# Altium schematic sheet AFE.SchDoc
size A3; SheetNumber: 7; SheetTotal: 10
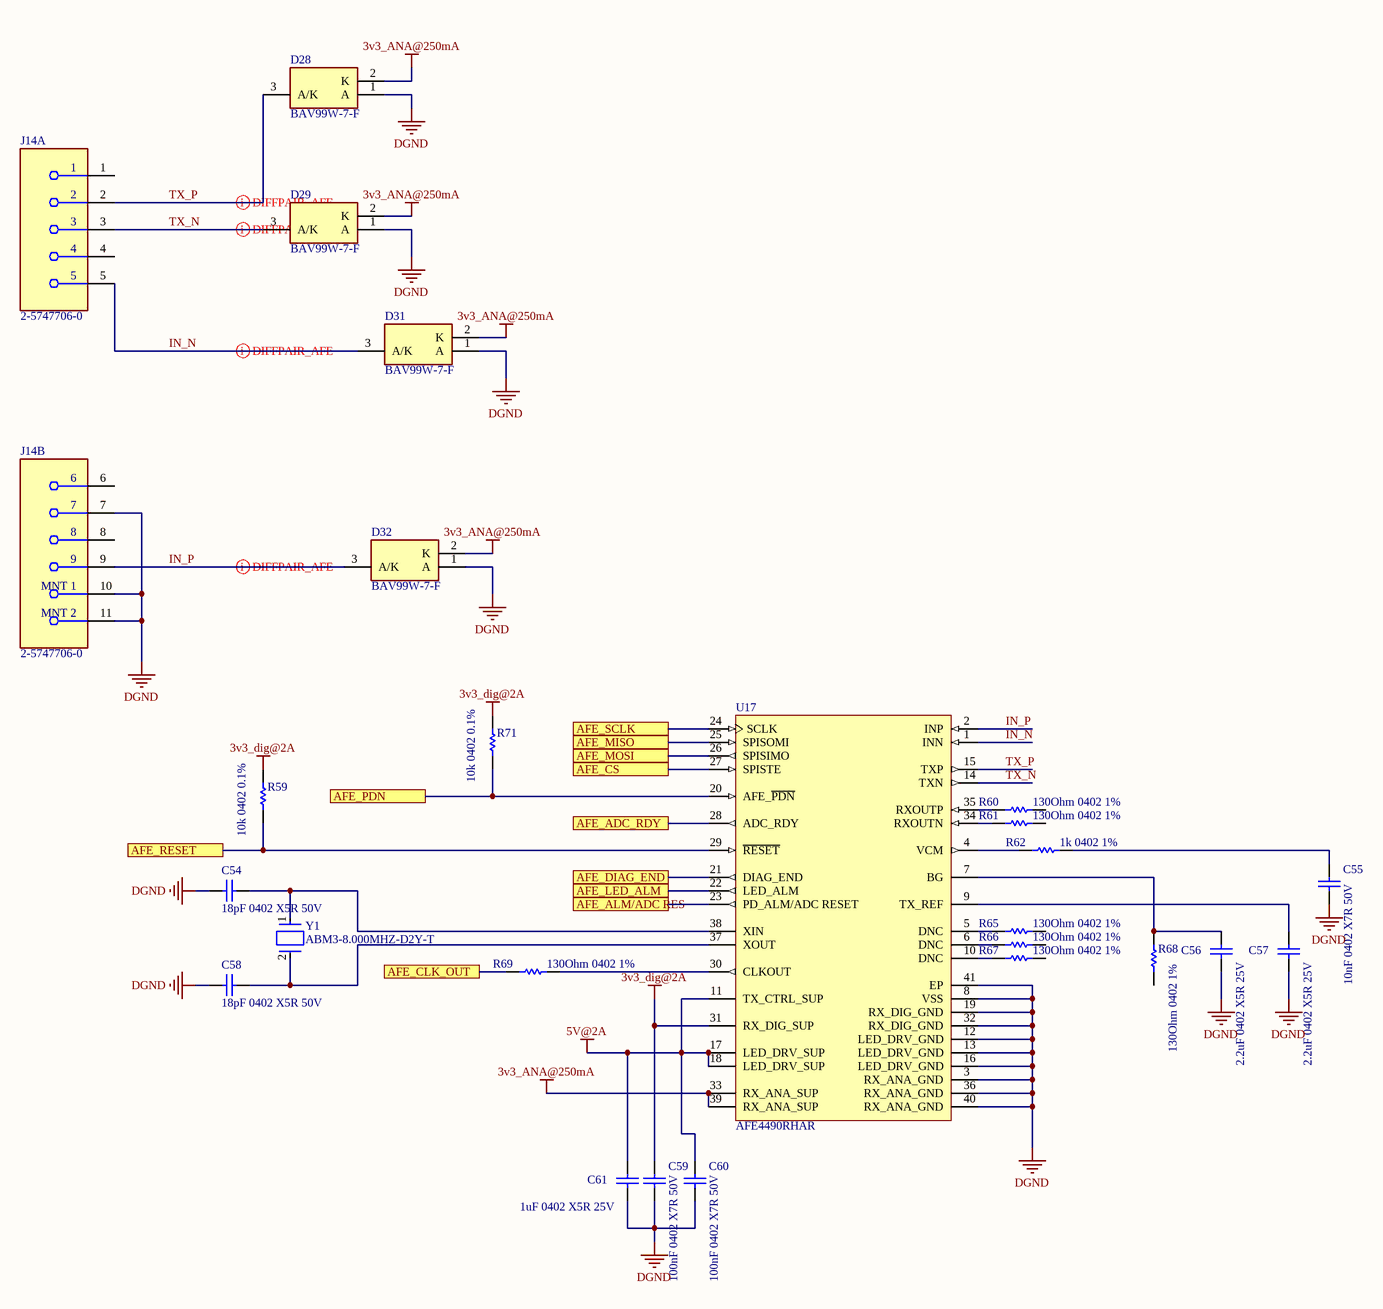
[diagram p0: AFE.SchDoc]

## Parts
C54  18pF 0402 X5R 50V  [CAPC1005X55X25NL5T10]
C55  10nF 0402 X7R 50V  [CAPC1005X55X25NL5T10]
C56  2.2uF 0402 X5R 25V  [CAPC1005X55X25NL5T10]
C57  2.2uF 0402 X5R 25V  [CAPC1005X55X25NL5T10]
C58  18pF 0402 X5R 50V  [CAPC1005X55X25NL5T10]
C59  100nF 0402 X7R 50V  [CAPC1005X55X25NL5T10]
C60  100nF 0402 X7R 50V  [CAPC1005X55X25NL5T10]
C61  1uF 0402 X5R 25V  [CAPC1005X55X25NL5T10]
D28  BAV99W-7-F  [SOT65P210X110-3N]
D29  BAV99W-7-F  [SOT65P210X110-3N]
D31  BAV99W-7-F  [SOT65P210X110-3N]
D32  BAV99W-7-F  [SOT65P210X110-3N]
J14  2-5747706-0  [FP-2-5747706-0-MFG]  (parts A,B of 2)
R59  10k 0402 0.1%  [RESC1005X40X25ML05T10]
R60  130Ohm 0402 1%  [RESC1005X40X25ML05T10]
R61  130Ohm 0402 1%  [RESC1005X40X25ML05T10]
R62  1k 0402 1%  [RESC1005X40X25ML05T10]
R65  130Ohm 0402 1%  [RESC1005X40X25ML05T10]
R66  130Ohm 0402 1%  [RESC1005X40X25ML05T10]
R67  130Ohm 0402 1%  [RESC1005X40X25ML05T10]
R68  130Ohm 0402 1%  [RESC1005X40X25ML05T10]
R69  130Ohm 0402 1%  [RESC1005X40X25ML05T10]
R71  10k 0402 0.1%  [RESC1005X40X25ML05T10]
U17  AFE4490RHAR  [RHA0040B_V]
Y1  ABM3-8.000MHZ-D2Y-T  [FP-ABM3-MFG]

## Ports
AFE_ADC_RDY, AFE_ALM/ADC RES, AFE_CLK_OUT, AFE_CS, AFE_DIAG_END, AFE_LED_ALM, AFE_MISO, AFE_MOSI, AFE_PDN, AFE_RESET, AFE_SCLK

## Nets
3v3_ANA@250mA: D28.2(K) D29.2(K) D31.2(K) D32.2(K) U17.33(RX_ANA_SUP) U17.39(RX_ANA_SUP)
3v3_dig@2A: C59.2 R59.2 R71.2 U17.31(RX_DIG_SUP)
5V@2A: C60.2 C61.2 U17.11(TX_CTRL_SUP) U17.17(LED_DRV_SUP) U17.18(LED_DRV_SUP)
DGND: C54.1 C55.1 C56.1 C57.1 C58.1 C59.1 C60.1 C61.1 D28.1(A) D29.1(A) D31.1(A) D32.1(A) J14.7 J14.10(MNT_1) J14.11(MNT_2) U17.3(RX_ANA_GND) U17.8(VSS) U17.12(LED_DRV_GND) U17.13(LED_DRV_GND) U17.16(LED_DRV_GND) U17.19(RX_DIG_GND) U17.32(RX_DIG_GND) U17.36(RX_ANA_GND) U17.40(RX_ANA_GND) U17.41(EP)
AFE_ADC_RDY: U17.28(ADC_RDY) ; port AFE_ADC_RDY
AFE_ALM/ADC RES: U17.23(PD_ALM/ADC_RESET) ; port AFE_ALM/ADC RES
AFE_CLK_OUT: R69.2 ; port AFE_CLK_OUT
AFE_CS: U17.27(SPISTE) ; port AFE_CS
AFE_DIAG_END: U17.21(DIAG_END) ; port AFE_DIAG_END
AFE_LED_ALM: U17.22(LED_ALM) ; port AFE_LED_ALM
AFE_MISO: U17.25(SPISOMI) ; port AFE_MISO
AFE_MOSI: U17.26(SPISIMO) ; port AFE_MOSI
AFE_PDN: R71.1 U17.20(AFE_~{PDN}) ; port AFE_PDN
AFE_RESET: R59.1 U17.29(~{RESET}) ; port AFE_RESET
AFE_SCLK: U17.24(SCLK) ; port AFE_SCLK
IN_N: D31.3(A/K) J14.5 U17.1(INN)
IN_P: D32.3(A/K) J14.9 U17.2(INP)
TX_N: D29.3(A/K) J14.3 U17.14(TXN)
TX_P: D28.3(A/K) J14.2 U17.15(TXP)
NetC54_2: C54.2 U17.38(XIN) Y1.1
NetC55_2: C55.2 R62.1
NetC56_2: C56.2 R68.2 U17.7(BG)
NetC57_2: C57.2 U17.9(TX_REF)
NetC58_2: C58.2 U17.37(XOUT) Y1.2
NetR60_2: R60.2 U17.35(RXOUTP)
NetR61_2: R61.2 U17.34(RXOUTN)
NetR62_2: R62.2 U17.4(VCM)
NetR65_2: R65.2 U17.5(DNC)
NetR66_2: R66.2 U17.6(DNC)
NetR67_2: R67.2 U17.10(DNC)
NetR69_1: R69.1 U17.30(CLKOUT)

Not connected (* = marked no-connect by the designer): J14 1 4 6 8; R60 1; R61 1; R65 1; R66 1; R67 1; R68 1

## Layout directives
differential pair; differential pair class AFE: IN_N, IN_P, TX_N, TX_P

## Library data of the parts
C54-C61 = CMP-1662-00020-1: ComponentLink2Description: Datasheet; ComponentLink2URL: http://psearch.en.murata.com/capacitor/product/GRM155R60J105KE19%23.pdf; ComponentLink1Description: Manufacturer URL; ComponentLink1URL: http://www.murata.com/
  C54 C58: LCSC_PN: C33149
  C55: LCSC_PN: C60133
  C56 C57: LCSC_PN: C77002
  C59 C60: LCSC_PN: C77020
  C61: LCSC_PN: C77009
D28 D29 D31 D32 = BAV99W-7-F: Diode; Manufacturer_Name: Diodes Inc.; Datasheet Link: https://www.diodes.com/assets/Datasheets/ds30045.pdf; Height: 1.1mm; Manufacturer_Part_Number: BAV99W-7-F; Mouser Part Number: 621-BAV99W-F; Mouser Price/Stock: https://www.mouser.co.uk/ProductDetail/Diodes-Incorporated/BAV99W-7-F?qs=KrBKXozF1ElcNxS3QKF7wg%3D%3D; Arrow Part Number: BAV99W-7-F; Arrow Price/Stock: https://www.arrow.com/en/products/bav99w-7-f/diodes-incorporated?region=europe; LCSC_PN: C93035
J14 = CMP-03367-000004-1: CONN D-SUB RCPT 9POS VERT SOLDER; Manufacturer: TE Connectivity; Is Female: yes; Conn Orientation: Vertical; Current Rating: 6A; Shielding: true; Number Of Contacts: 9; Conn Gender: Female; Pitch: 2.74mm; RoHS: TRUE; Temperature: -55°C to +105°C; Package: 2-5747706-0; Category: Conn; Automotive: No; Device Class L3: unset; Octopart: https://octopart.com/2-5747706-0-te+connectivity-39499683; Lead Free: Yes; Contact Material: Gold,Nickel; Height: 0.494inch; Temperature Range High: +105°C; Device Class L1: Connectors; ComponentLink2Description: Datasheet; Mouser Description: D-Sub Standard Connectors RECP FRNT MTL SHL 9P retention inserts; ComponentLink2URL: https://www.te.com/commerce/DocumentDelivery/DDEController?Action=showdoc&DocId=Customer+Drawing%7F5747706%7FB%7Fpdf%7FEnglish%7FENG_CD_5747706_B.pdf%7F2-5747706-0; Digikey Description: CONN D-SUB RCPT 9POS VERT SOLDER; Temperature Range Low: -55°C; Manufacturer Part Number: 2-5747706-0; Device Class L2: D-Sub Connectors; LCSC_PN: C189689
R59-R62 R65-R69 R71 = CMP-2002-07472-1
  R59 R71: LCSC_PN: C190095
  R60 R61 R65-R69: LCSC_PN: C413066
  R62: LCSC_PN: C106235
U17 = CMP-0767-00003-2: Integrated Analog Front End for Pulse Oximeter, 2 to 3.6 V Rx, 3 to 5.25 V Tx, -40 to 85 degC, 40-Pin VQFN (RHA), RoHS, Tape and Reel; Manufacturer: Texas Instruments; CMRR: 75 dB; Resolution: 22 Bits; Sample Rate (max): 1.3 KSPS; Packing: RHA0040B; # Input Channels: 1; ComponentLink3Description: Package Specification; ComponentLink2Description: Datasheet; RoHS: TRUE; ComponentLink2URL: http://www.ti.com/lit/ds/symlink/afe4490.pdf; ComponentLink1Description: Manufacturer URL; DatasheetVersion: SBAS602F; AFE Digital Supply: 2 to 3.6 V; ComponentLink1URL: http://www.ti.com/; PartNumber: AFE4490RHAR; PackageVersion: 4204276/E; Operating Temperature Range: -40 to 85 degC; PackageReference: RHA-40; PackageDescription: 40-Pin Plastic Quad Flatpack No-Lead, Body 6 x 6 mm, Pitch 0.5 mm; Transmit Controller Supply: 3 to 5.25 V; ComponentLink3URL: http://www.ti.com.cn/cn/lit/ml/mpqf135c/mpqf135c.pdf; AFE Analog Supply: 2 to 3.6 V; Mounting Technology: Surface Mount; LCSC_PN: C2651608
Y1 = CMP-2000-05033-2: Crystal 8MHz ±20ppm 18pF SMD-2 5mm x 3.2mm; Series Resistance: 500R; Frequency Stability: 30ppm; ESR (Equivalent Series Resistance): 140R; Load Capacitance: 18pF; Height: 0.051inch; Tolerance: 20ppm; Depth: 3.2mm; Max Operating Temperature: 85°C; Frequency: 8MHz; Termination: SMD/SMT; Lead Free: Lead Free; Number of Pins: 2; Width: 3.2mm; RoHS Compliant: Yes; Resistor Type: Ceramic; Length: 5mm; Mount: Surface Mount; Case/Package: CSMD; Package Quantity: 1000; Radiation Hardening: No; Min Operating Temperature: -40°C; Packaging: Tape and Reel; Frequency Tolerance: 20ppm; LCSC_PN: C144380